# EAGLE design Fingerprint_UP_BA (EAGLE 5.04)
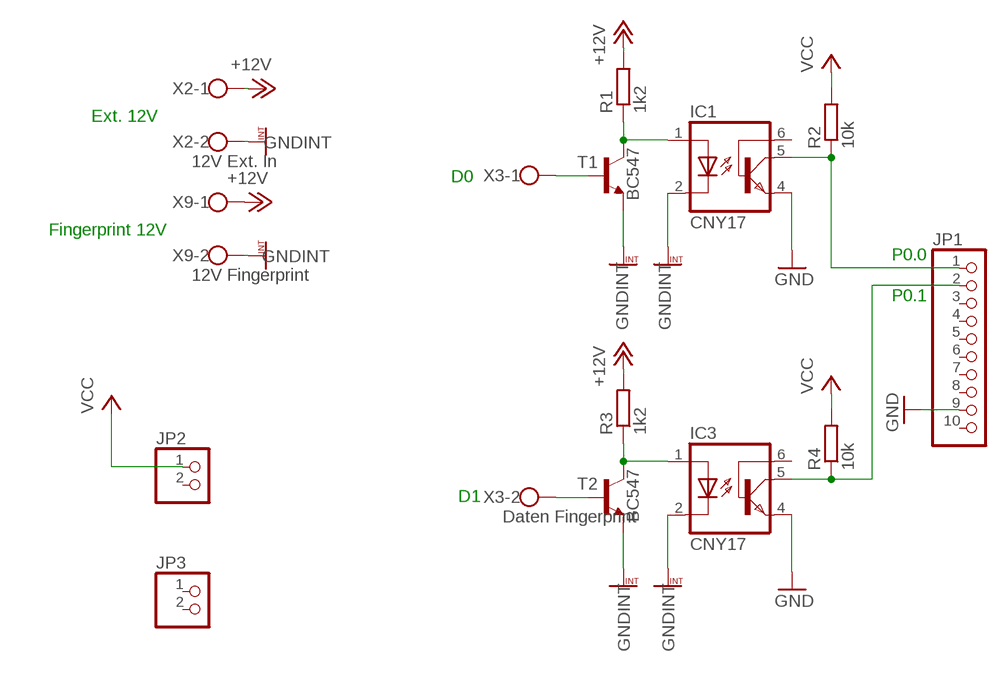
[diagram p0: schematic, sheet 1]

## Parts
IC1  CNY17  [DIL06]
IC3  CNY17  [DIL06]
JP1  PINHD-1X10  [1X10]
JP2  PINHD-1X2  [1X02]
JP3  PINHD-1X2  [1X02]
R1  1k2  R-EU_0204/7  [0204/7]
R2  10k  R-EU_0204/7  [0204/7]
R3  1k2  R-EU_0204/7  [0204/7]
R4  10k  R-EU_0204/7  [0204/7]
T1  BC547  [TO92]
T2  BC547  [TO92]
X2  12V Ext. In  W237-102  [W237-102]
X3  Daten Fingerprint  W237-102  [W237-102]
X9  12V Fingerprint  W237-102  [W237-102]

## Nets
+12V: R1.2 R3.2 X2.1 X9.1
GND: IC1.4(EMI) IC3.4(EMI) JP1.9
GNDINT: IC1.2(C) IC3.2(C) T1.1(E) T2.1(E) X2.2 X9.2
N$2: IC1.1(A) R1.1 T1.3(C)
N$4: T1.2(B) X3.1
N$8: IC1.5(COL) JP1.1 R2.1
N$9: IC3.1(A) R3.1 T2.3(C)
N$10: T2.2(B) X3.2
N$13: IC3.5(COL) JP1.2 R4.1
VCC: JP2.1 R2.2 R4.2
Unconnected: IC1.6(BAS) IC3.6(BAS) JP1.3 JP1.4 JP1.5 JP1.6 JP1.7 JP1.8 JP1.10 JP2.2 JP3.1 JP3.2

## Notes on the sheet
- Ext. 12V
- D0
- Fingerprint 12V
- P0.0
- P0.1
- D1

## Library data of the parts
IC1 IC3 = optocoupler:CNY17: SIEMENS OPTO COUPLER
JP1 = pinhead:PINHD-1X10: PIN HEADER
JP2 JP3 = pinhead:PINHD-1X2: PIN HEADER
R1-R4 = rcl:R-EU_: RESISTOR, European symbol
T1 T2 = transistor-neu-to92:BC547: NPN TRANSISTOR
X2 X3 X9 = con-wago-500:W237-102: WAGO SCREW CLAMP

## Board
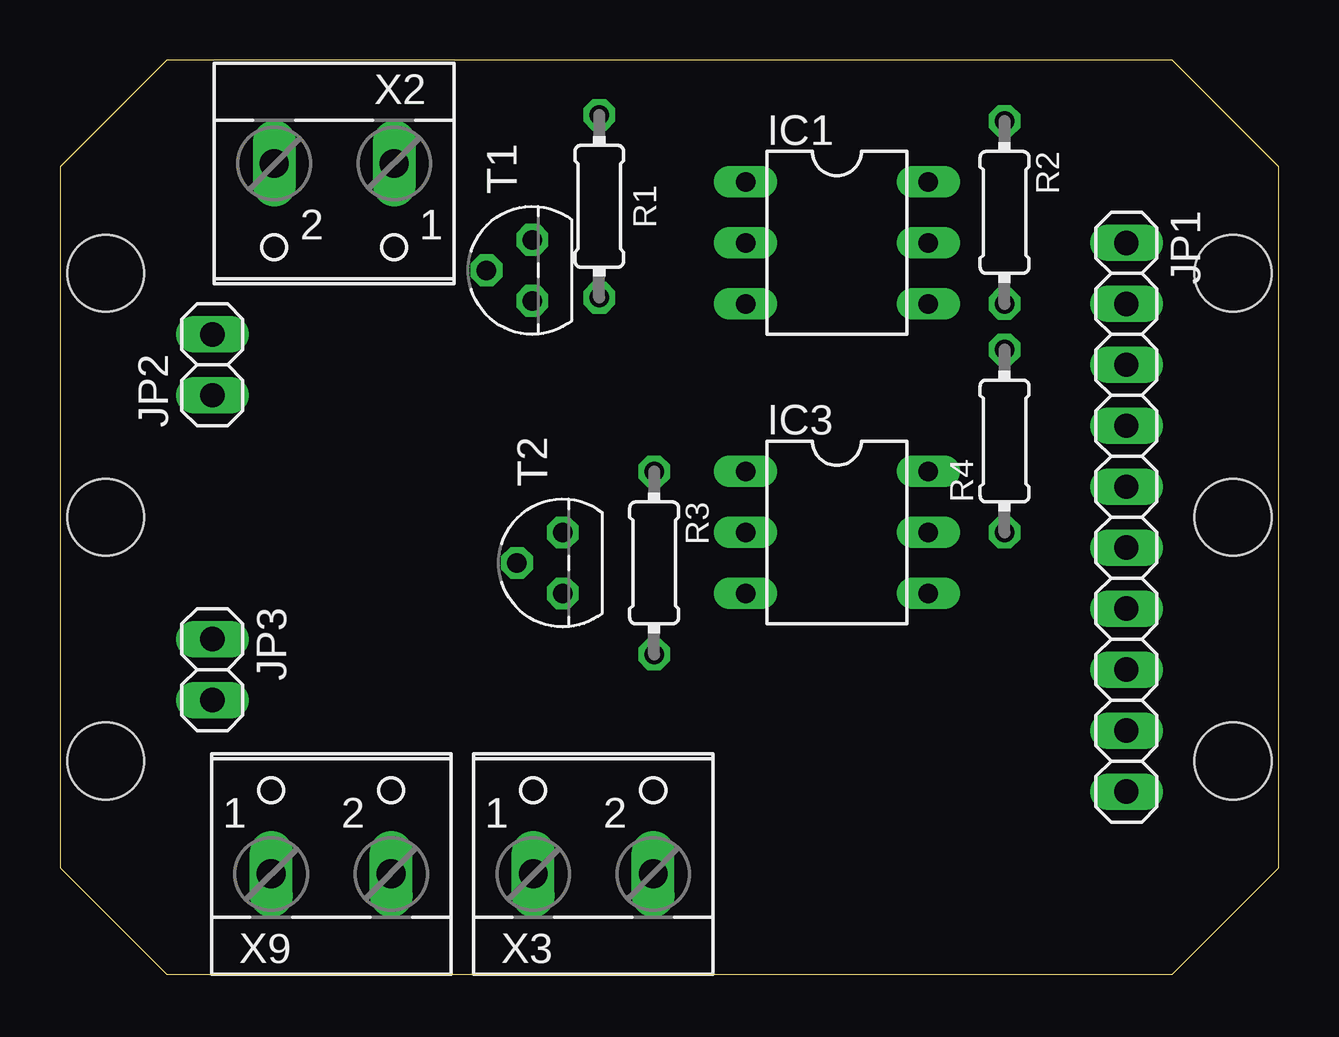
[diagram p1: board, top side]
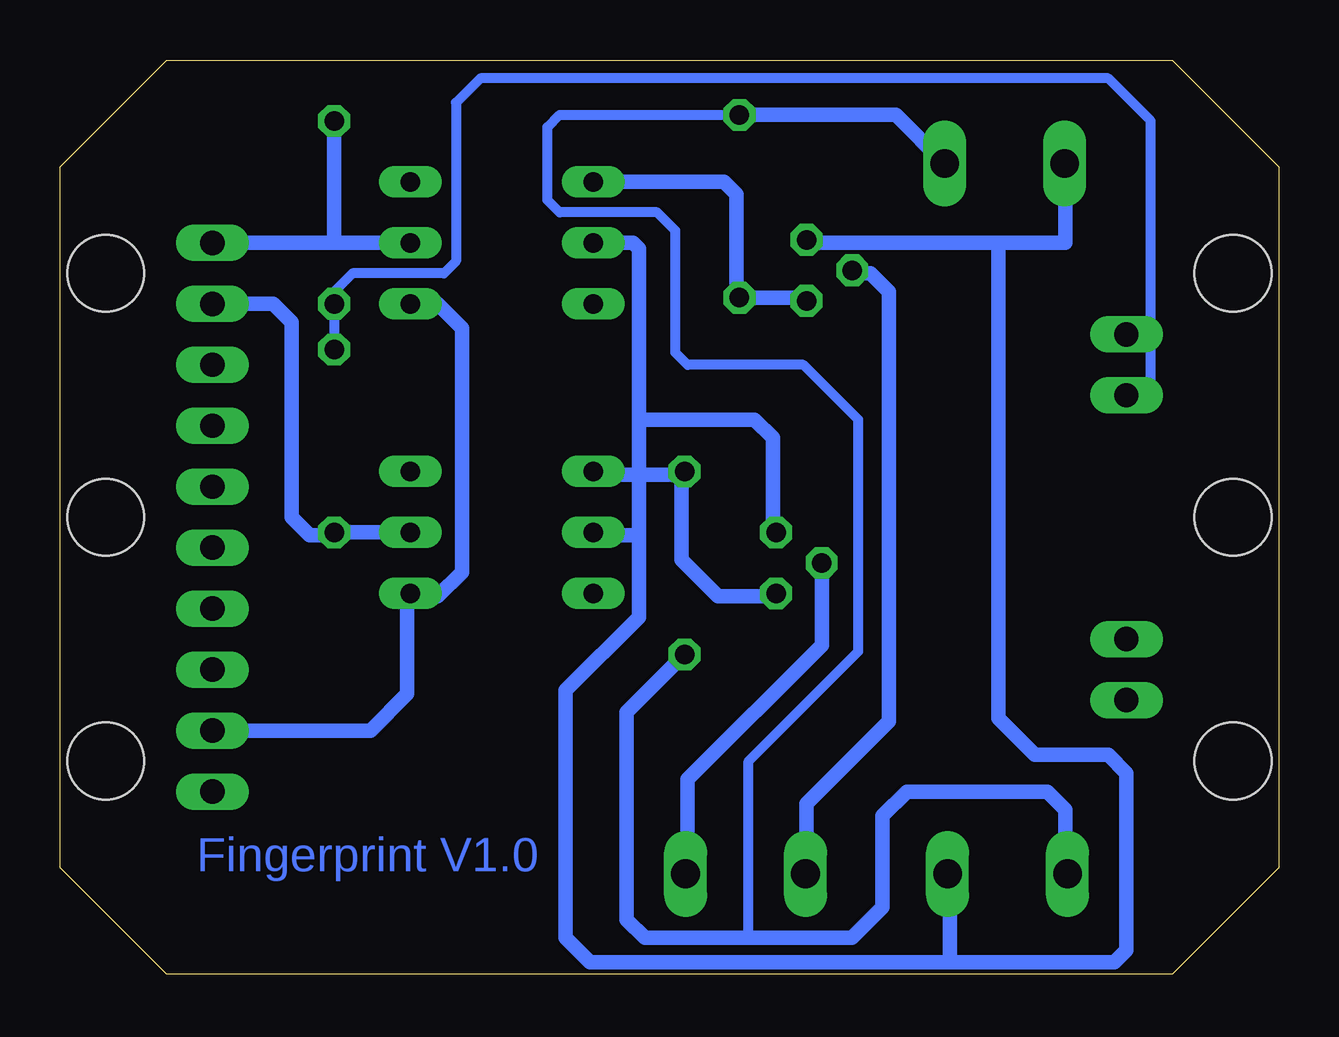
[diagram p2: board, bottom side, seen from below]

Size 50.8 x 38.1 mm. Coordinates in mm from the lower left corner, seen from the top.
Outline: 0,4.45 4.45,0 46.35,0 50.8,4.45 50.8,33.66 46.35,38.1 4.45,38.1 0,33.66 0,4.45
Copper layers (1*16): Top 0.035mm / dielectric 1.5mm / Bottom 0.035mm
Design rules "default *": minimum track width 10mil, minimum drill 24mil, track to track 16mil, track to pad 16mil, pad to pad 16mil, via to via 16mil, smd to smd 8mil, copper to edge 20mil, drill to drill 8mil, minimum pad ring 10mil, minimum via ring 8mil, stop-mask expansion 4mil, vias tented up to drill 0mil, thermal gap 10mil
Holes 3.2 mm at 1.91,19.05 1.91,29.21 1.91,8.89 48.9,19.05 48.9,29.21 48.9,8.89

### Footprints (pad centres in the part's own frame; a part is rotated, then mirrored left to right if it is on the bottom)
DIL06 = drill 0.813 long: 1 -2.54,-3.81; 2 0,-3.81; 3 2.54,-3.81; 4 2.54,3.81; 5 0,3.81; 6 -2.54,3.81
1X10 = drill 1.016 long: 1 -11.43,0; 2 -8.89,0; 3 -6.35,0; 4 -3.81,0; 5 -1.27,0; 6 1.27,0; 7 3.81,0; 8 6.35,0; 9 8.89,0; 10 11.43,0
1X02 = drill 1.016 long: 1 -1.27,0; 2 1.27,0
0204/7 = drill 0.813 octagon: 1 -3.81,0; 2 3.81,0
TO92 = drill 0.813 octagon: 1 1.27,0; 2 0,1.905; 3 -1.27,0
W237-102 = drill 1.194 long: 1 -2.5,-1.27; 2 2.5,-1.27

### Placement (x,y rotation side)
IC1  32.38,30.48 270 top
IC3  32.38,18.41 270 top
JP1  44.45,19.05 270 top
JP2  6.35,25.4 90 top
JP3  6.35,12.7 270 top
R1  22.48,32 90 top
R2  39.37,31.75 270 top
R3  24.77,17.14 270 top
R4  39.37,22.23 90 top
T1  19.68,29.34 90 top
T2  20.95,17.14 90 top
X2  11.43,32.51 180 top
X3  22.23,5.46 0 top
X9  11.3,5.46 0 top

### Tracks (layer width: path | path; a pad name or v marks a point on that pad's centre or on a via)
+12V
  Bottom 0.406: 22.1,1.52 22.1,8.89 17.53,13.46 17.53,23.11 19.81,25.4 24.64,25.4 25.15,25.91 25.15,30.99 25.91,31.75 29.97,31.75 30.48,32.26 30.48,35.31 29.97,35.81 22.61,35.81
  Bottom 0.61: X2.1 15.96,35.81 R1.2 22.61,35.81 | R3.2 27.18,10.92 27.18,2.29 26.42,1.52 22.1,1.52 17.78,1.52 16.51,2.79 16.51,6.6 15.49,7.62 9.65,7.62 8.89,6.86 8.89,4.1 | 8.89,4.1 8.89,4.06 | X9.1 8.89,4.1
GND
  Bottom 0.61: JP1.9 37.85,10.16 36.32,11.68 36.32,15.75 | 36.32,15.75 36.32,16 IC3.4 36.32,15.75 | IC1.4 35.05,27.94 34.04,26.92 34.04,16.76 35.05,15.75 36.32,15.75
GNDINT
  Bottom 0.61: 26.67,18.29 26.67,14.89 29.72,11.84 29.72,4.32 29.72,4.06 29.72,1.52 28.7,0.51 13.72,0.51 | 26.67,18.29 26.67,23.11 | 26.67,23.11 26.67,30.23 26.92,30.48 IC1.2 28.7,30.48 | IC3.2 28.45,18.29 26.67,18.29 | X2.2 8.89,33.74 8.89,30.48 11.68,30.48 | T2.1 21.08,18.54 21.08,22.35 21.84,23.11 26.67,23.11 | 13.72,0.51 6.86,0.51 6.35,1.02 6.35,8.38 7.11,9.14 10.16,9.14 11.68,10.67 11.68,30.48 | X9.2 13.72,4.1 13.72,0.51 | T1.1 19.56,30.48 11.68,30.48
N$2
  Bottom 0.61: R1.1 22.61,28.19 | T1.3 19.81,28.19 R1.1 | R1.1 22.61,28.32 22.61,32.51 23.11,33.02 IC1.1 28.7,33.02
N$4
  Bottom 0.61: T1.2 17.78,29.21 17.02,29.21 16.26,28.45 16.26,10.54 19.68,7.11 19.68,4.23 X3.1
N$8
  Bottom 0.61: IC1.5 39.37,30.48 | 39.37,30.48 JP1.1 | 39.37,30.48 R2.1
N$9
  Bottom 0.61: T2.3 21.08,15.75 23.37,15.75 24.89,17.27 24.89,20.83 | IC3.1 28.7,20.83 24.89,20.83 | 24.89,20.83 R3.1
N$10
  Bottom 0.61: 19.05,17.27 T2.2 19.05,13.72 24.64,8.13 24.64,4.28 X3.2
N$13
  Bottom 0.61: JP1.2 41.91,27.94 41.15,27.18 41.15,19.05 40.39,18.29 39.37,18.29 | 39.37,18.29 R4.1 | IC3.5 39.24,18.41 39.37,18.29
VCC
  Bottom 0.406: JP2.1 5.33,24.13 5.33,35.56 7.11,37.34 33.27,37.34 34.29,36.32 34.29,29.72 34.8,29.21 38.61,29.21 39.37,28.45 R2.2 R4.2 39.37,25.91

### Text on the board
Bottom: Fingerprint V1.0